# Altium schematic sheet L9741.SchDoc
size A4; SheetNumber: 5; SheetTotal: 8; SPICEModelCacheKCFYWLGF: <root> / <DocumentId>KCFYWLGF</DocumentId> / <CacheFrame Number="0"> / <Model Name="dpsw2" Kind="CKT"> / <Text>* DIP switch 2 / * jjt 19/6/2002: created / * / *             Switch connections: / *             sw1 / *             |  |  sw2 / *             |  |  |  | / *             |  |  |  | / .subckt dpsw2 1  2  4  5 / + PARAMS: STATE1=0 STATE2=0 RON=1m ROFF=100E6 / * / V1 3 0 {STATE1} / V2 6 0 {STATE2} / * / SDIP1 1 2 3 0 DIPMOD / SDIP2 4 5 6 0 DIPMOD / * / .MODEL DIPMOD SW(VT=0.5 RON={RON} ROFF={ROFF}) / .ends dpsw2</Text> / </Model> / </CacheFrame> / </root>
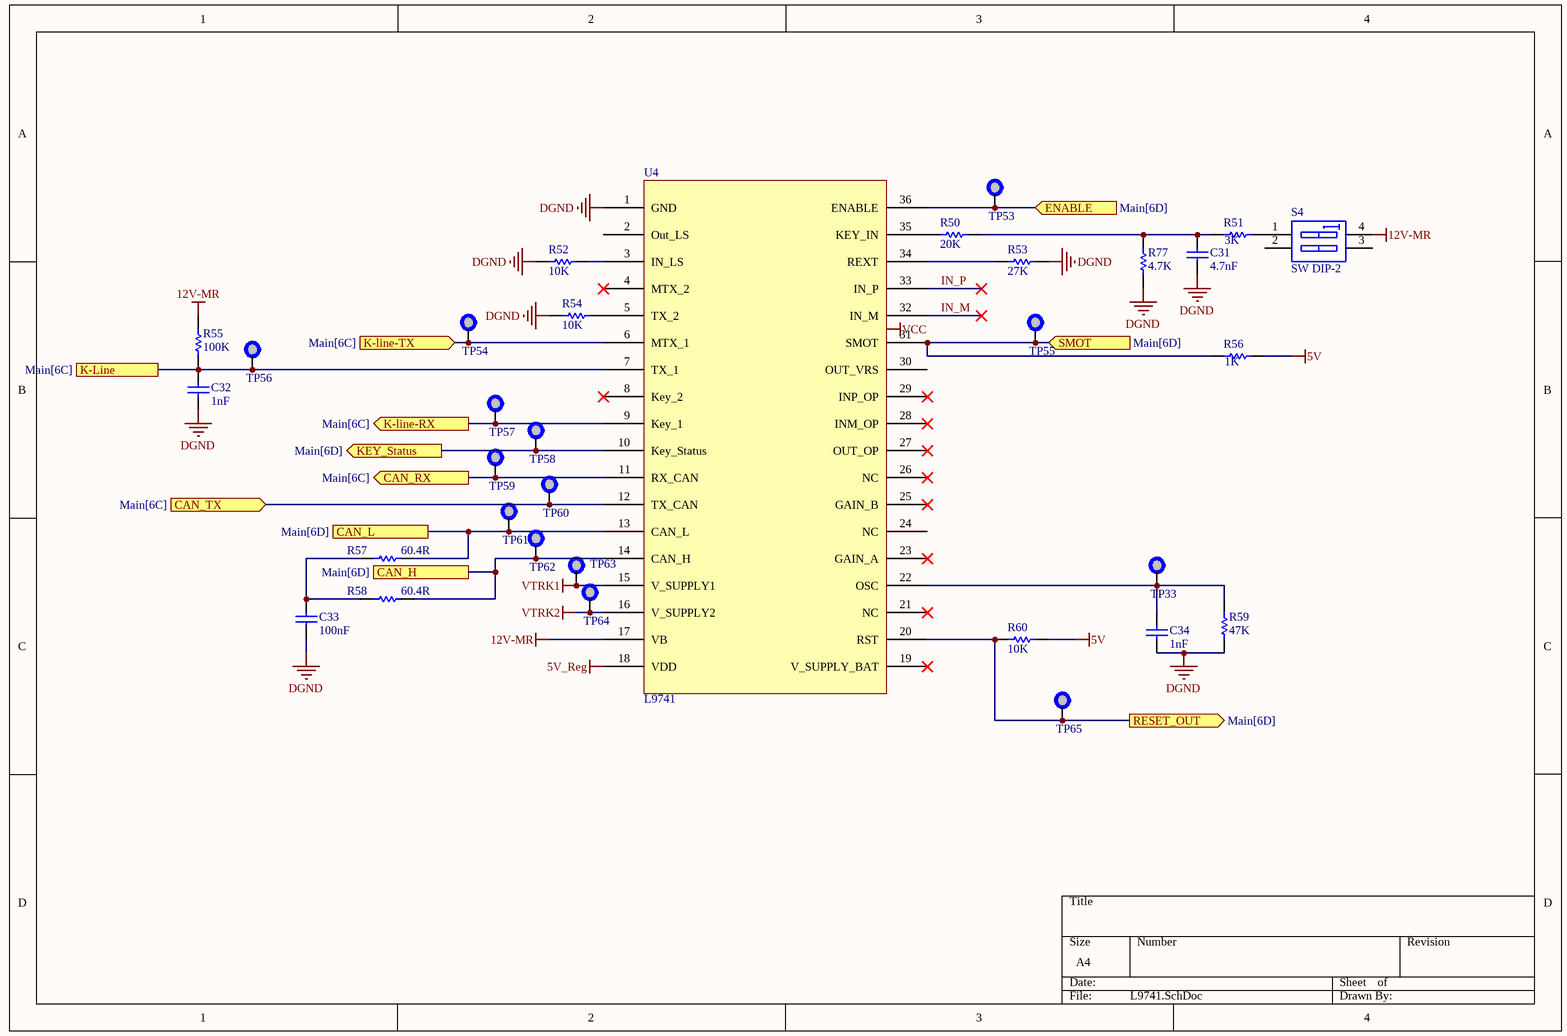
[diagram p0: L9741.SchDoc]

## Parts
C31  value 4.7nF  [0805C]  (hidden comment: CGA5L1X7R1H106K160AC)
C32  value 1nF  [0603C]  (hidden comment: CGA3E2X7R1H104K080AA)
C33  value 100nF  [0603C]  (hidden comment: CGA3E2X7R1H104K080AA)
C34  value 1nF  [0805C]  (hidden comment: CGA5L1X7R1H106K160AC)
R50  value 20K  [0805]  (hidden comment: Res1)
R51  value 3K  [0805]  (hidden comment: Res1)
R52  value 10K  [0805]  (hidden comment: Res1)
R53  value 27K  [0805]  (hidden comment: Res1)
R54  value 10K  [0805]  (hidden comment: Res1)
R55  value 100K  [0805]  (hidden comment: Res1)
R56  value 1K  [0805]  (hidden comment: Res1)
R57  value 60.4R  [1206]  (hidden comment: Res1)
R58  value 60.4R  [1206]  (hidden comment: Res1)
R59  value 47K  [0805]  (hidden comment: Res1)
R60  value 10K  [0805]  (hidden comment: Res1)
R77  value 4.7K  [0805]  (hidden comment: Res1)
S4  SW DIP-2  [DIP-4]
TP33  TestPoint  [TP]  (value not drawn)
TP53  TestPoint  [TP]  (value not drawn)
TP54  TestPoint  [TP]  (value not drawn)
TP55  TestPoint  [TP]  (value not drawn)
TP56  TestPoint  [TP]  (value not drawn)
TP57  TestPoint  [TP]  (value not drawn)
TP58  TestPoint  [TP]  (value not drawn)
TP59  TestPoint  [TP]  (value not drawn)
TP60  TestPoint  [TP]  (value not drawn)
TP61  TestPoint  [TP]  (value not drawn)
TP62  TestPoint  [TP]  (value not drawn)
TP63  TestPoint  [TP]  (value not drawn)
TP64  TestPoint  [TP]  (value not drawn)
TP65  TestPoint  [TP]  (value not drawn)
U4  L9741  [L9741]

## Ports
CAN_H (see Main[6D]), CAN_L (see Main[6D]), CAN_RX (out, see Main[6C]), CAN_TX (in, see Main[6C]), ENABLE (in, see Main[6D]), K-Line (see Main[6C]), K-line-RX (out, see Main[6C]), K-line-TX (in, see Main[6C]), KEY_Status (out, see Main[6D]), RESET_OUT (out, see Main[6D]), SMOT (in, see Main[6D])

## Nets
5V: R56.2 R60.1
5V_Reg: U4.18(VDD)
12V-MR: R55.1 S4.4(B1) U4.17(VB)
DGND: C31.1 C32.2 C33.2 C34.2 R52.2 R53.1 R54.2 R59.2 R77.2 U4.1(GND)
VTRK1: TP63.1 U4.15(V_SUPPLY1)
VTRK2: TP64.1 U4.16(V_SUPPLY2)
CAN_H: R58.2 TP62.1 U4.14(CAN_H) ; port CAN_H
CAN_L: R57.2 TP61.1 U4.13(CAN_L) ; port CAN_L
CAN_RX: TP59.1 U4.11(RX_CAN) ; port CAN_RX
CAN_TX: TP60.1 U4.12(TX_CAN) ; port CAN_TX
ENABLE: TP53.1 U4.36(ENABLE) ; port ENABLE
IN_M: U4.32(IN_M)
IN_P: U4.33(IN_P)
K-Line: C32.1 R55.2 TP56.1 U4.7(TX_1) ; port K-Line
K-line-RX: TP57.1 U4.9(Key_1) ; port K-line-RX
K-line-TX: TP54.1 U4.6(MTX_1) ; port K-line-TX
KEY_Status: TP58.1 U4.10(Key_Status) ; port KEY_Status
RESET_OUT: R60.2 TP65.1 U4.20(RST) ; port RESET_OUT
SMOT: R56.1 TP55.1 U4.31(SMOT) ; port SMOT
NetC31_2: C31.2 R50.1 R51.1 R77.1
NetC33_1: C33.1 R57.1 R58.1
NetC34_1: C34.1 R59.1 TP33.1 U4.22(OSC)
NetR50_2: R50.2 U4.35(KEY_IN)
NetR51_2: R51.2 S4.1(A1)
NetR52_1: R52.1 U4.3(IN_LS)
NetR53_2: R53.2 U4.34(REXT)
NetR54_1: R54.1 U4.5(TX_2)

Not connected (* = marked no-connect by the designer): S4 2(A2) 3(B2); U4 2(Out_LS) 4(MTX_2)* 8(Key_2)* 19(V_SUPPLY_BAT)* 21(NC)* 23(GAIN_A)* 24(NC) 25(GAIN_B)* 26(NC)* 27(OUT_OP)* 28(INM_OP)* 29(INP_OP)* 30(OUT_VRS)

## Notes on the sheet
- Labels drawn without touching a wire or pin: VCC

## Library data of the parts
C31-C34 = Cap: Capacitor; Published: 8-Jun-2000; LatestRevisionDate: 17-Jul-2002; LatestRevisionNote: Re-released for DXP Platform.; PackageReference: RAD-0.3; Publisher: Altium Limited; PackageDescription: Radial Cap, Thru-Hole; 2 Leads; 0.3 in Pin Spacing
R50-R60 R77 = Res1: Resistor; Published: 8-Jun-2000; LatestRevisionDate: 17-Jul-2002; LatestRevisionNote: Re-released for DXP Platform.; PackageReference: AXIAL-0.3; Publisher: Altium Limited; PackageDescription: Axial Device, Thru-Hole; 2 Leads; 0.3 in Pin Spacing
S4 = SW DIP-2: DIP Switch, 2 Position, SPST; Published: 24-Mar-1999; LatestRevisionDate: 17-Jul-2002; LatestRevisionNote: Re-released for DXP Platform.; PackageReference: DIP-4; Publisher: Altium Limited